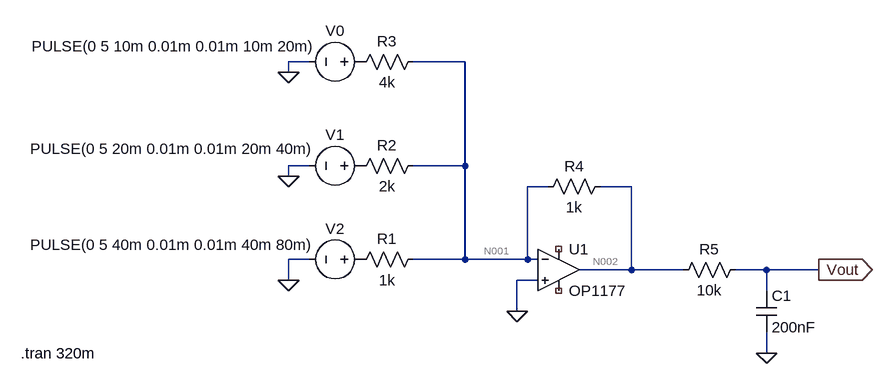
[diagram p0: schematic DAC_Simulation - LTSpice.asc]
DAC_Simulation - LTSpice.asc, the LTspice schematic file:
Version 4
SHEET 1 1424 680
WIRE 32 -192 0 -192
WIRE 272 -192 192 -192
WIRE 0 -176 0 -192
WIRE 32 -32 0 -32
WIRE 272 -32 272 -192
WIRE 272 -32 192 -32
WIRE 0 -16 0 -32
WIRE 400 0 368 0
WIRE 528 0 480 0
WIRE 32 112 0 112
WIRE 272 112 272 -32
WIRE 272 112 192 112
WIRE 368 112 368 0
WIRE 368 112 272 112
WIRE 384 112 368 112
WIRE 528 128 528 0
WIRE 528 128 448 128
WIRE 608 128 528 128
WIRE 736 128 688 128
WIRE 816 128 736 128
WIRE 0 144 0 112
WIRE 384 144 352 144
WIRE 736 160 736 128
WIRE 352 192 352 144
WIRE 736 256 736 224
FLAG 0 -176 0
FLAG 0 -16 0
FLAG 0 144 0
FLAG 352 192 0
FLAG 736 256 0
FLAG 816 128 Vout
IOPIN 816 128 Out
SYMBOL res 208 96 R90
WINDOW 0 0 56 VBottom 2
WINDOW 3 32 56 VTop 2
SYMATTR InstName R1
SYMATTR Value 1k
SYMBOL res 208 -48 R90
WINDOW 0 0 56 VBottom 2
WINDOW 3 32 56 VTop 2
SYMATTR InstName R2
SYMATTR Value 2k
SYMBOL res 208 -208 R90
WINDOW 0 0 56 VBottom 2
WINDOW 3 32 56 VTop 2
SYMATTR InstName R3
SYMATTR Value 4k
SYMBOL voltage 128 -192 R90
WINDOW 0 -32 56 VBottom 2
WINDOW 3 -40 304 VTop 2
WINDOW 123 0 0 Left 0
WINDOW 39 0 0 Left 0
SYMATTR InstName V0
SYMATTR Value PULSE(0 5 10m 0.01m 0.01m 10m 20m)
SYMBOL voltage 128 -32 R90
WINDOW 0 -32 56 VBottom 2
WINDOW 3 -42 306 VTop 2
WINDOW 123 0 0 Left 0
WINDOW 39 0 0 Left 0
SYMATTR InstName V1
SYMATTR Value PULSE(0 5 20m 0.01m 0.01m 20m 40m)
SYMBOL voltage 128 112 R90
WINDOW 0 -32 56 VBottom 2
WINDOW 3 -38 306 VTop 2
WINDOW 123 0 0 Left 0
WINDOW 39 0 0 Left 0
SYMATTR InstName V2
SYMATTR Value PULSE(0 5 40m 0.01m 0.01m 40m 80m)
SYMBOL res 496 -16 R90
WINDOW 0 0 56 VBottom 2
WINDOW 3 32 56 VTop 2
SYMATTR InstName R4
SYMATTR Value 1k
SYMBOL OpAmps\\OP1177 416 64 R0
SYMATTR InstName U1
SYMBOL res 704 112 R90
WINDOW 0 0 56 VBottom 2
WINDOW 3 32 56 VTop 2
SYMATTR InstName R5
SYMATTR Value 10k
SYMBOL cap 720 160 R0
SYMATTR InstName C1
SYMATTR Value 200nF
TEXT -412 256 Left 2 !.tran 320m

The netlist it stands for:
* DAC_Simulation - LTSpice.asc
R1 N001 P001 1k
R2 N001 P002 2k
R3 N001 P003 4k
V0 P003 0 PULSE(0 5 10m 0.01m 0.01m 10m 20m)
V1 P002 0 PULSE(0 5 20m 0.01m 0.01m 20m 40m)
V2 P001 0 PULSE(0 5 40m 0.01m 0.01m 40m 80m)
R4 N002 N001 1k
XU1 0 N001 NC_01 NC_02 N002 OP1177  ; pins In+ In- V+ V- OUT
R5 Vout N002 10k
C1 Vout 0 200nF
.tran 320m
.lib ADI1.lib
.backanno
.end

* Results of the author's LTspice run, read from the files saved beside the schematic
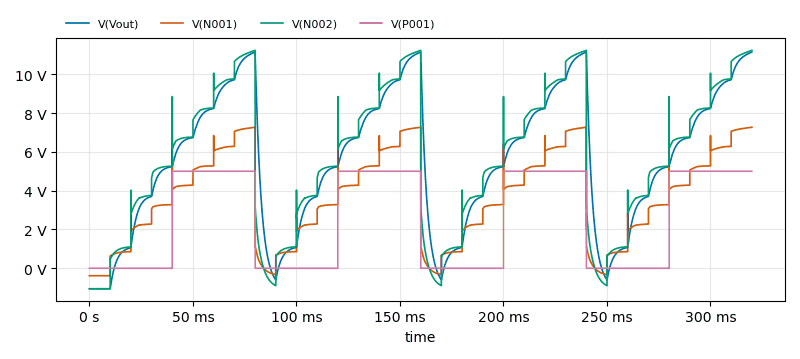
[diagram p1: Transient Analysis of DAC_Simulation - LTSpice.asc, plotted from the saved traces]
* Transient Analysis, 1 run:
*   V(Vout): min -1.06 V, max 11.14 V, average 5.53 V, rms 6.607 V, last 11.14 V
*   V(N001): min -385.4 mV, max 7.265 V, average 3.63 V, rms 4.353 V, last 7.265 V
*   V(N002): min -1.06 V, max 11.23 V, average 5.607 V, rms 6.748 V, last 11.23 V
*   V(P001): min 0 V, max 5 V, average 2.5 V, rms 3.536 V, last 5 V